# Altium schematic sheet ADIO.SCHDOC
size B
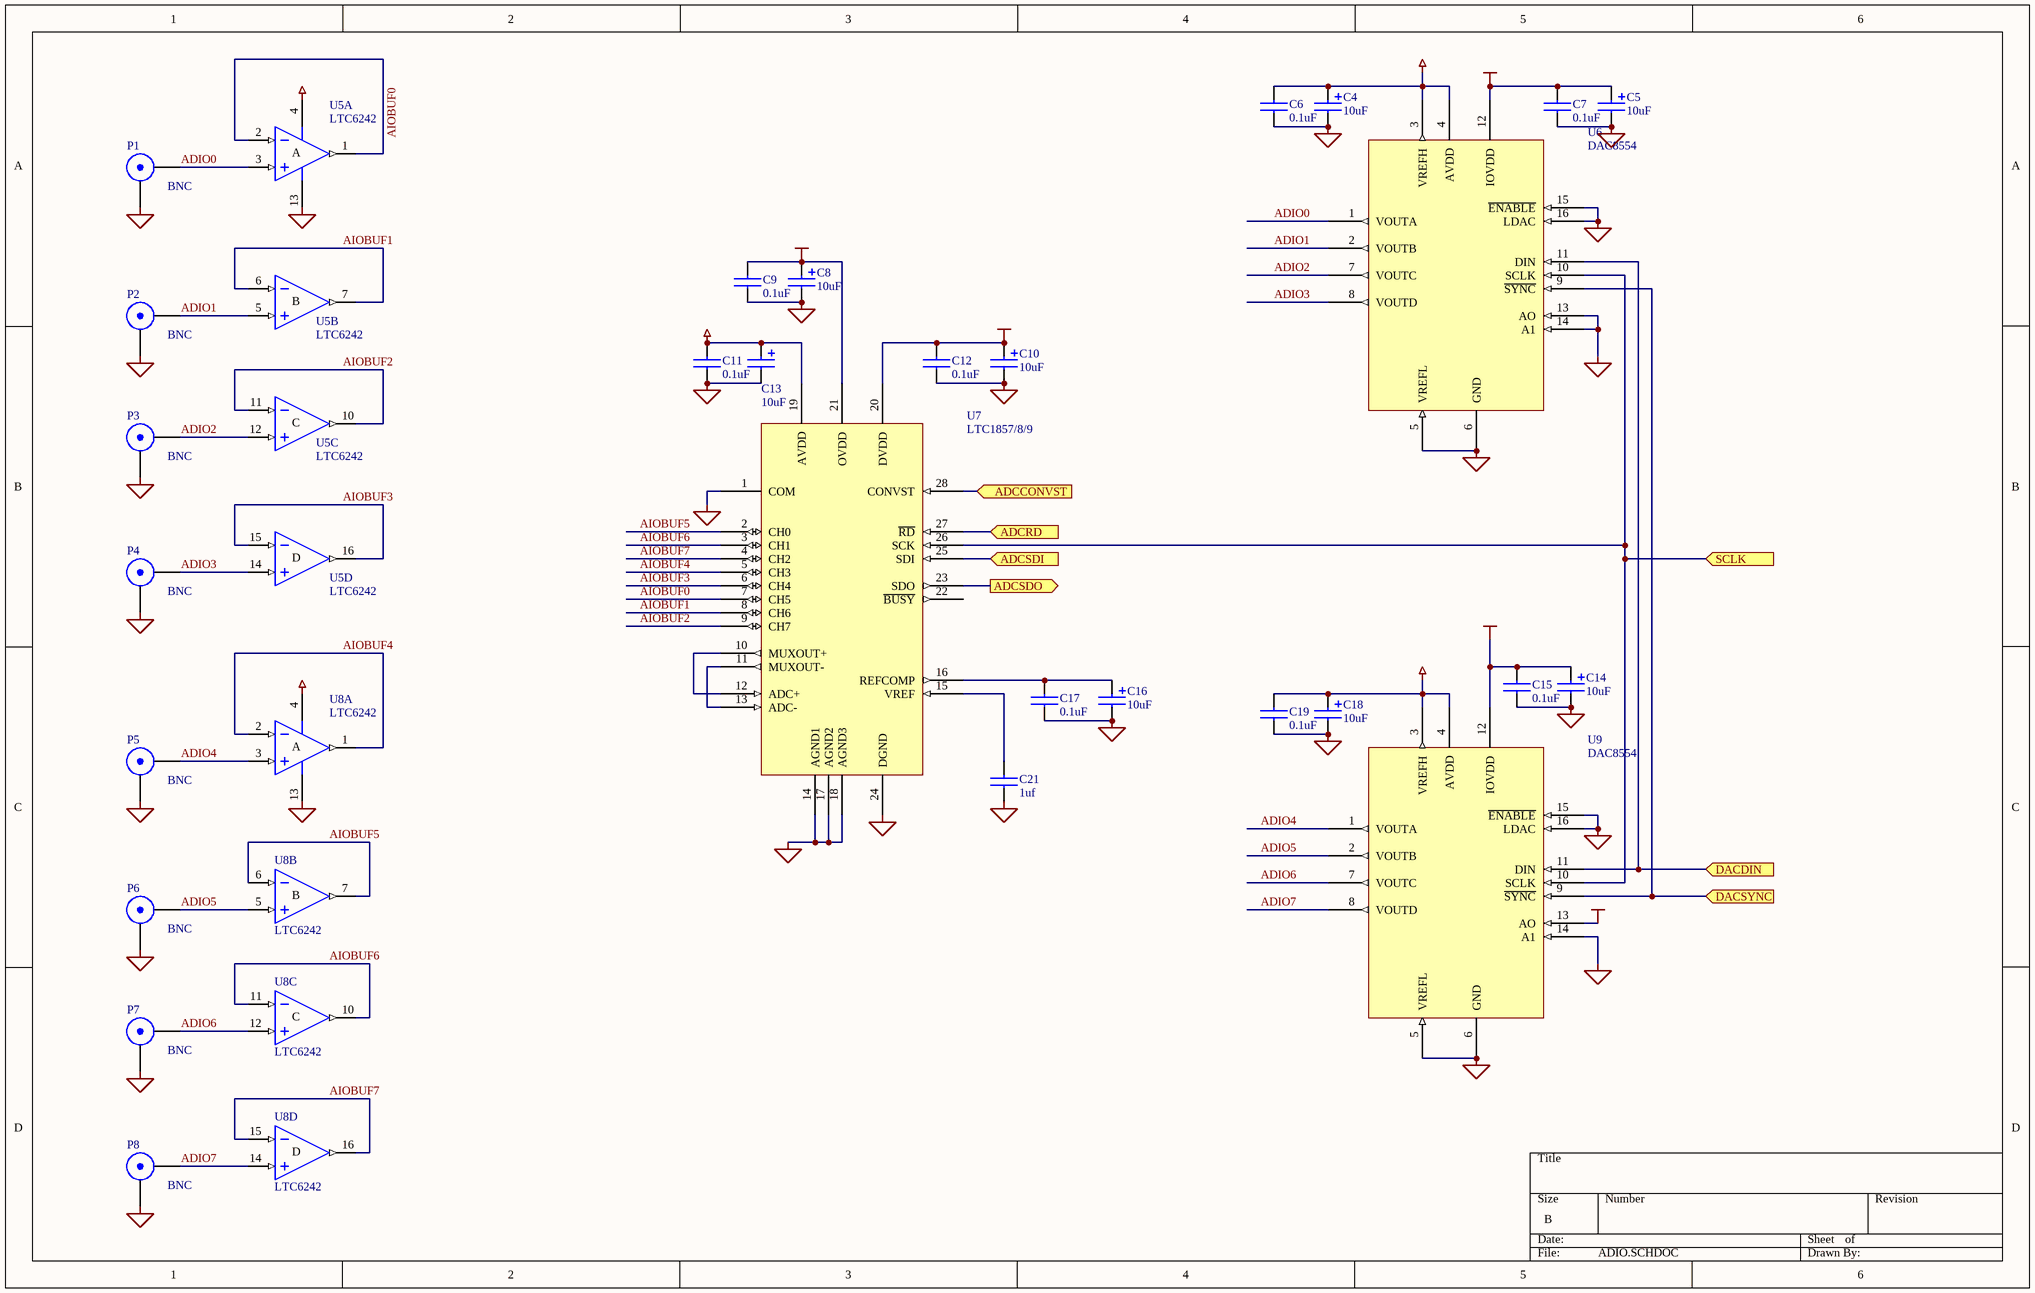
[diagram p0: ADIO.SCHDOC]

## Parts
C4  value 10uF  [3216]  (hidden comment: POLCAP)
C5  value 10uF  [3216]  (hidden comment: POLCAP)
C6  value 0.1uF  [0603]  (hidden comment: CAPACITOR)
C7  value 0.1uF  [0603]  (hidden comment: CAPACITOR)
C8  value 10uF  [3216]  (hidden comment: POLCAP)
C9  value 0.1uF  [0603]  (hidden comment: CAPACITOR)
C10  value 10uF  [3216]  (hidden comment: POLCAP)
C11  value 0.1uF  [0603]  (hidden comment: CAPACITOR)
C12  value 0.1uF  [0603]  (hidden comment: CAPACITOR)
C13  value 10uF  [3216]  (hidden comment: POLCAP)
C14  value 10uF  [3216]  (hidden comment: POLCAP)
C15  value 0.1uF  [0603]  (hidden comment: CAPACITOR)
C16  value 10uF  [3216]  (hidden comment: POLCAP)
C17  value 0.1uF  [0603]  (hidden comment: CAPACITOR)
C18  value 10uF  [3216]  (hidden comment: POLCAP)
C19  value 0.1uF  [0603]  (hidden comment: CAPACITOR)
C21  value 1uf  [0603]  (hidden comment: CAPACITOR)
P1  BNC  [Vertical BNC 227699-1]
P2  BNC  [Vertical BNC 227699-1]
P3  BNC  [Vertical BNC 227699-1]
P4  BNC  [Vertical BNC 227699-1]
P5  BNC  [Vertical BNC 227699-1]
P6  BNC  [Vertical BNC 227699-1]
P7  BNC  [Vertical BNC 227699-1]
P8  BNC  [Vertical BNC 227699-1]
U5  LTC6242  [LTCDHC-16]  (parts A,B,C,D of 4)
U6  DAC8554  [TSSO5x6-G16]
U7  LTC1857/8/9  [LTI_G_TSSOP]
U8  LTC6242  [LTCDHC-16]  (parts A,B,C,D of 4)
U9  DAC8554  [TSSO5x6-G16]

## Ports
ADCCONVST (in), ADCRD (in), ADCSDI (in), ADCSDO (out), DACDIN (in), DACSYNC (in), SCLK (in)

## Nets
+5VCC: C10.1 C12.1 U7.20(DVDD)
AVDD: C4.1 C6.1 C11.1 C13.1 C18.1 C19.1 U5.4(V+) U6.3(VREFH) U6.4(AVDD) U7.19(AVDD) U8.4(V+) U9.3(VREFH) U9.4(AVDD)
GND: C4.2 C5.2 C6.2 C7.2 C8.2 C9.2 C10.2 C11.2 C12.2 C13.2 C14.2 C15.2 C16.2 C17.2 C18.2 C19.2 C21.2 P1.2(Y) P2.2(Y) P3.2(Y) P4.2(Y) P5.2(Y) P6.2(Y) P7.2(Y) P8.2(Y) U5.13(V-) U6.5(VREFL) U6.6(GND) U6.13(AO) U6.14(A1) U6.15(~{ENABLE}) U6.16(LDAC) U7.1(COM) U7.14(AGND1) U7.17(AGND2) U7.18(AGND3) U7.24(DGND) U8.13(V-) U9.5(VREFL) U9.6(GND) U9.14(A1) U9.15(~{ENABLE}) U9.16(LDAC)
VCC: C5.1 C7.1 C8.1 C9.1 C14.1 C15.1 U6.12(IOVDD) U7.21(OVDD) U9.12(IOVDD) U9.13(AO)
ADCCONVST: U7.28(CONVST) ; port ADCCONVST
ADCRD: U7.27(~{RD}) ; port ADCRD
ADCSDI: U7.25(SDI) ; port ADCSDI
ADCSDO: U7.23(SDO) ; port ADCSDO
ADIO0: P1.1(X) U5.3(IN+) U6.1(VOUTA)
ADIO1: P2.1(X) U5.5(IN+) U6.2(VOUTB)
ADIO2: P3.1(X) U5.12(IN+) U6.7(VOUTC)
ADIO3: P4.1(X) U5.14(IN+) U6.8(VOUTD)
ADIO4: P5.1(X) U8.3(IN+) U9.1(VOUTA)
ADIO5: P6.1(X) U8.5(IN+) U9.2(VOUTB)
ADIO6: P7.1(X) U8.12(IN+) U9.7(VOUTC)
ADIO7: P8.1(X) U8.14(IN+) U9.8(VOUTD)
AIOBUF0: U5.1(OUT) U5.2(IN-) U7.7(CH5)
AIOBUF1: U5.6(IN-) U5.7(OUT) U7.8(CH6)
AIOBUF2: U5.10(OUT) U5.11(IN-) U7.9(CH7)
AIOBUF3: U5.15(IN-) U5.16(OUT) U7.6(CH4)
AIOBUF4: U7.5(CH3) U8.1(OUT) U8.2(IN-)
AIOBUF5: U7.2(CH0) U8.6(IN-) U8.7(OUT)
AIOBUF6: U7.3(CH1) U8.10(OUT) U8.11(IN-)
AIOBUF7: U7.4(CH2) U8.15(IN-) U8.16(OUT)
DACDIN: U6.11(DIN) U9.11(DIN) ; port DACDIN
DACSYNC: U6.9(~{SYNC}) U9.9(~{SYNC}) ; port DACSYNC
SCLK: U6.10(SCLK) U7.26(SCK) U9.10(SCLK) ; port SCLK
NetC16_1: C16.1 C17.1 U7.16(REFCOMP)
NetC21_1: C21.1 U7.15(VREF)
NetU7_10: U7.10(MUXOUT+) U7.12(ADC+)
NetU7_11: U7.11(MUXOUT-) U7.13(ADC-)

Not connected (* = marked no-connect by the designer): U7 22(~{BUSY})

## Notes on the sheet
- (in symbol LTC6242, part A) A
- (in symbol LTC6242, part B) B
- (in symbol LTC6242, part C) C
- (in symbol LTC6242, part D) D

## Library data of the parts
C4 C5 C8 C10 C13 C14 C16 C18 = POLCAP: Standard Capacitor; Type: Tantalum
C6 C7 C9 C11 C12 C15 C17 C19 C21 = CAPACITOR: Standard Capacitor; Type: X7R
P1-P8 = BNC: BNC Elbow Connector; Manufacturer: Generic Components; Class II: RF Coaxial; Revision: July-2002: Re-released for DXP Platform.; Publisher: Altium Limited; Class I: Connector
U5 U8 = LTC6242: Quad 18 Mhz, Low Noise, Rail-to-Rail CMOS Op-Amp; Published: 8-Jun-2000; LatestRevisionDate: 6-Jun-2005; DatasheetDocument: 1996; Publisher: Altium Limited
U6 U9 = DAC8554: TI 16-bit quad chan Voltage Output DAC
U7 = LTC1859: LTC 8-channel 12, 14, 16 100ksps ADC